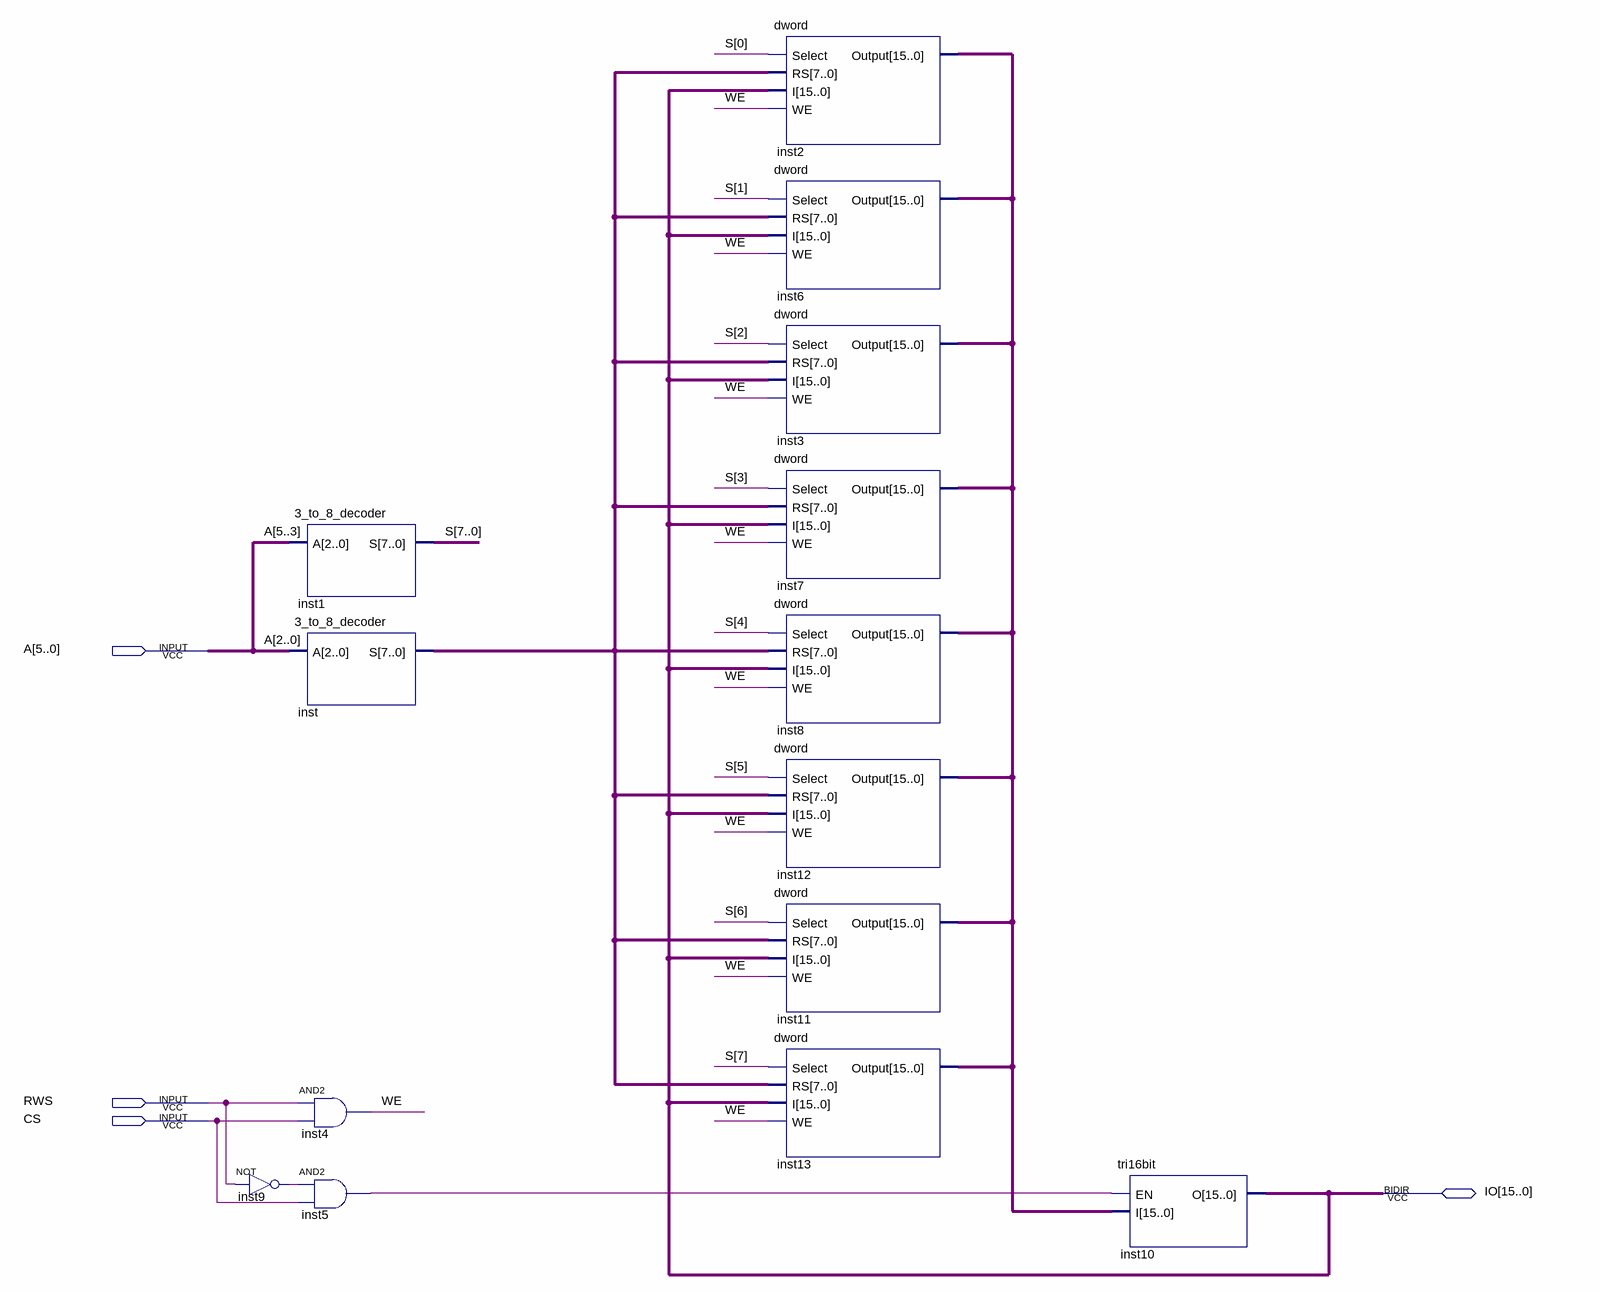
[diagram p0: schematic sheet]
// Quartus schematic DMem64x16.bdf as structural Verilog: 14 symbols, 4 pins
module DMem64x16 (
  input  [5:0] A,
  input  RWS,
  input  CS,
  inout  [15:0] IO
);

  wire inst5_out, inst9_out, WE;
  wire [7:0] inst_s, S;
  wire [15:0] inst2_output;

  not inst9 (inst9_out, RWS);
  \3_to_8_decoder  inst1 (.A(A[5:3]), .S(S));
  \3_to_8_decoder  inst (.A(A[2:0]), .S(inst_s));
  and inst4 (WE, RWS, CS);
  and inst5 (inst5_out, inst9_out, CS);
  dword inst2 (.Select(S[0]), .RS(inst_s), .I(IO), .WE(WE), .Output(inst2_output));
  dword inst6 (.Select(S[1]), .RS(inst_s), .I(IO), .WE(WE), .Output(inst2_output));
  dword inst3 (.Select(S[2]), .RS(inst_s), .I(IO), .WE(WE), .Output(inst2_output));
  dword inst7 (.Select(S[3]), .RS(inst_s), .I(IO), .WE(WE), .Output(inst2_output));
  dword inst8 (.Select(S[4]), .RS(inst_s), .I(IO), .WE(WE), .Output(inst2_output));
  dword inst12 (.Select(S[5]), .RS(inst_s), .I(IO), .WE(WE), .Output(inst2_output));
  dword inst11 (.Select(S[6]), .RS(inst_s), .I(IO), .WE(WE), .Output(inst2_output));
  dword inst13 (.Select(S[7]), .RS(inst_s), .I(IO), .WE(WE), .Output(inst2_output));
  tri16bit inst10 (.EN(inst5_out), .I(inst2_output), .O(IO));
endmodule
